# EAGLE schematic lau_ard8pin (EAGLE 9.6.2)
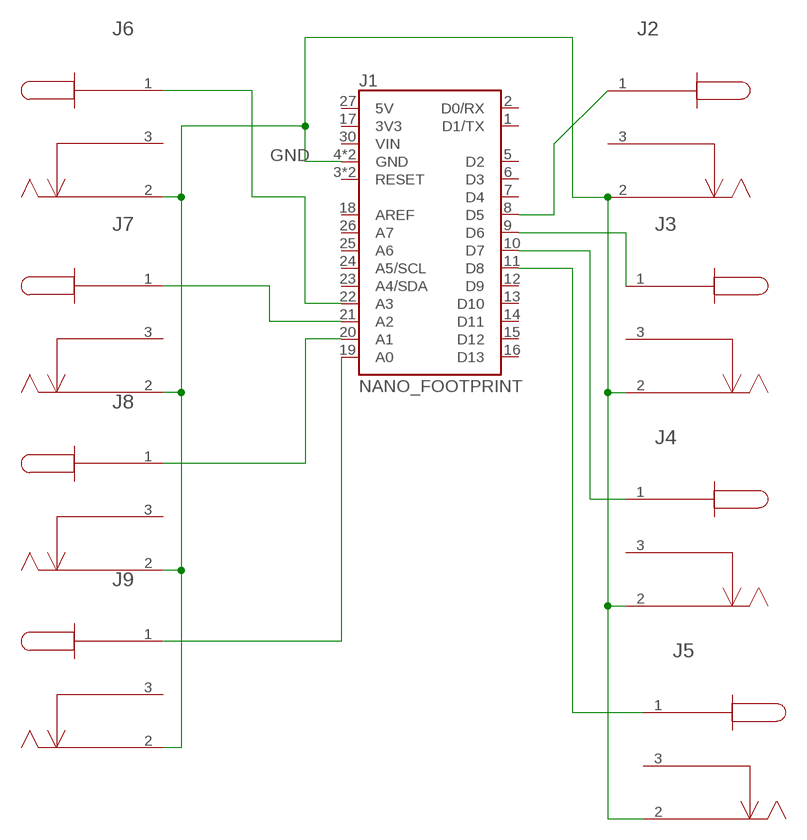
[diagram p0: schematic, sheet 1]

## Parts
J1  NANO_FOOTPRINT  [NANO]
J2  694106105102  [CONN3_06105102_WRE]
J3  694106105102  [CONN3_06105102_WRE]
J4  694106105102  [CONN3_06105102_WRE]
J5  694106105102  [CONN3_06105102_WRE]
J6  694106105102  [CONN3_06105102_WRE]
J7  694106105102  [CONN3_06105102_WRE]
J8  694106105102  [CONN3_06105102_WRE]
J9  694106105102  [CONN3_06105102_WRE]

## Nets
GND: J1.4(GND) J1.29(GND) J2.2 J3.2 J4.2 J5.2 J6.2 J7.2 J8.2 J9.2
N$1: J1.8(D5) J2.1
N$2: J1.9(D6) J3.1
N$3: J1.10(D7) J4.1
N$4: J1.11(D8) J5.1
N$5: J1.19(A0) J9.1
N$6: J1.20(A1) J8.1
N$7: J1.21(A2) J7.1
N$8: J1.22(A3) J6.1
Unconnected: J1.1(D1/TX) J1.2(D0/RX) J1.3(RESET) J1.5(D2) J1.6(D3) J1.7(D4) J1.12(D9) J1.13(D10) J1.14(D11) J1.15(D12) J1.16(D13) J1.17(3V3) J1.18(AREF) J1.23(A4/SDA) J1.24(A5/SCL) J1.25(A6) J1.26(A7) J1.27(5V) J1.28(RESET) J1.30(VIN) J2.3 J3.3 J4.3 J5.3 J6.3 J7.3 J8.3 J9.3

## Library data of the parts
J1 = SparkFun-Boards:NANO_FOOTPRINT: Generic Nano Footprint
J2-J9 = connector:694106105102; COPYRIGHT: Copyright (C) 2022 Ultra Librarian. All rights reserved.; DIGI-KEY_PART_NUMBER_1: 732-5928-2-ND; DIGI-KEY_PART_NUMBER_2: 732-5928-1-ND; DIGI-KEY_PART_NUMBER_3: 732-5928-6-ND; MANUFACTURER_PART_NUMBER: 694106105102; MFR_NAME: Wurth Electronics